# Altium schematic sheet alim_logique_hard.SchDoc: Projet M1 2024
size A4; DrawnBy: J.CLEMENT & D.FOURNIER; Revision: V1.0 Rev A; SheetNumber: 3; SheetTotal: 7
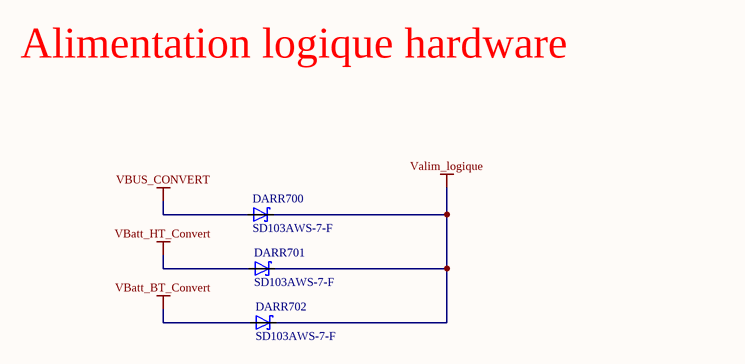
[diagram p0: alim_logique_hard.SchDoc]

## Parts
DARR700  SD103AWS-7-F  [SD103AWS-7-F]
DARR701  SD103AWS-7-F  [SD103AWS-7-F]
DARR702  SD103AWS-7-F  [SD103AWS-7-F]

## Nets
Valim_logique: DARR700.1(C) DARR701.1(C) DARR702.1(C)
VBatt_BT_Convert: DARR702.2(A)
VBatt_HT_Convert: DARR701.2(A)
VBUS_CONVERT: DARR700.2(A)

## Notes on the sheet
- Alimentation logique hardware

## Library data of the parts
DARR700-DARR702 = SD103AWS-7-F: Diode Array 3 Independent Schottky 40V 175mA Surface Mount 6-TSSOP, SC-88, SOT-363